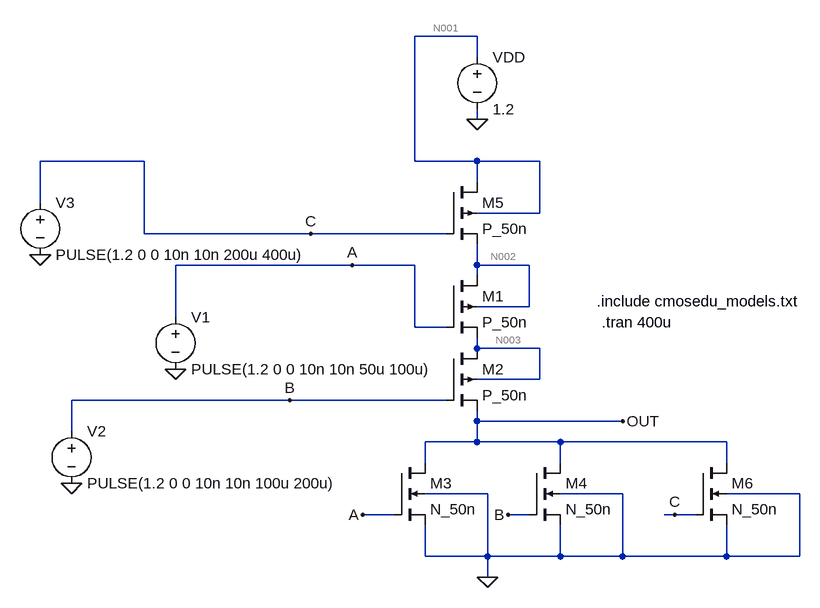
[diagram p0: schematic OR 2 entradas.asc]
OR 2 entradas.asc, the LTspice schematic file:
Version 4
SHEET 1 880 680
WIRE 208 -320 112 -320
WIRE 208 -288 208 -320
WIRE 208 -192 208 -208
WIRE -304 -128 -464 -128
WIRE 112 -128 112 -320
WIRE 208 -128 112 -128
WIRE 304 -128 208 -128
WIRE 208 -96 208 -128
WIRE -464 -64 -464 -128
WIRE 304 -48 304 -128
WIRE 304 -48 208 -48
WIRE -304 -16 -304 -128
WIRE -48 -16 -304 -16
WIRE 160 -16 -48 -16
WIRE 16 32 -256 32
WIRE 112 32 16 32
WIRE 208 32 208 0
WIRE 288 32 208 32
WIRE 208 48 208 32
WIRE 288 96 288 32
WIRE 288 96 208 96
WIRE -256 112 -256 32
WIRE 112 128 112 32
WIRE 160 128 112 128
WIRE 208 160 208 144
WIRE 304 160 208 160
WIRE 304 208 304 160
WIRE 304 208 208 208
WIRE -80 240 -416 240
WIRE 160 240 -80 240
WIRE 208 272 208 256
WIRE 432 272 208 272
WIRE -416 288 -416 240
WIRE 208 304 208 272
WIRE 208 304 128 304
WIRE 336 304 208 304
WIRE 592 304 336 304
WIRE 128 336 128 304
WIRE 336 336 336 304
WIRE 592 336 592 304
WIRE 224 384 128 384
WIRE 432 384 336 384
WIRE 704 384 592 384
WIRE 80 416 32 416
WIRE 288 416 256 416
WIRE 512 416 496 416
WIRE 544 416 512 416
WIRE 128 480 128 432
WIRE 224 480 224 384
WIRE 224 480 128 480
WIRE 336 480 336 432
WIRE 336 480 224 480
WIRE 432 480 432 384
WIRE 432 480 336 480
WIRE 592 480 592 432
WIRE 592 480 432 480
WIRE 704 480 704 384
WIRE 704 480 592 480
WIRE 224 512 224 480
FLAG 208 -192 0
FLAG 256 416 B
FLAG 32 416 A
FLAG 224 512 0
FLAG -256 192 0
FLAG -416 368 0
FLAG 432 272 OUT
FLAG -80 240 B
FLAG -464 16 0
FLAG -48 -16 C
FLAG 16 32 A
FLAG 512 416 C
SYMBOL pmos4 160 48 R0
SYMATTR InstName M1
SYMATTR Value P_50n
SYMATTR Value2 l=50n w=1.12u
SYMBOL pmos4 160 160 R0
SYMATTR InstName M2
SYMATTR Value P_50n
SYMATTR Value2 l=50n w=1.12u
SYMBOL nmos4 80 336 R0
SYMATTR InstName M3
SYMATTR Value N_50n
SYMATTR Value2 l=50n w=0.5u
SYMBOL nmos4 288 336 R0
SYMATTR InstName M4
SYMATTR Value N_50n
SYMATTR Value2 l=50n w=0.5u
SYMBOL voltage 208 -304 R0
WINDOW 123 0 0 Left 2
WINDOW 39 0 0 Left 2
SYMATTR InstName VDD
SYMATTR Value 1.2
SYMBOL voltage -256 96 R0
WINDOW 123 0 0 Left 2
WINDOW 39 0 0 Left 2
SYMATTR InstName V1
SYMATTR Value PULSE(1.2 0 0 10n 10n 50u 100u)
SYMBOL voltage -416 272 R0
WINDOW 123 0 0 Left 2
WINDOW 39 0 0 Left 2
SYMATTR InstName V2
SYMATTR Value PULSE(1.2 0 0 10n 10n 100u 200u)
SYMBOL pmos4 160 -96 R0
SYMATTR InstName M5
SYMATTR Value P_50n
SYMATTR Value2 l=50n w=1.12u
SYMBOL voltage -464 -80 R0
SYMATTR InstName V3
SYMATTR Value PULSE(1.2 0 0 10n 10n 200u 400u)
SYMBOL nmos4 544 336 R0
SYMATTR InstName M6
SYMATTR Value N_50n
SYMATTR Value2 l=50n w=0.5u
TEXT 392 88 Left 2 !.include cmosedu_models.txt
TEXT 400 120 Left 2 !.tran 400u

The netlist it stands for:
* OR 2 entradas.asc
M1 N002 A N003 N002 P_50n l=50n w=1.12u
M2 N003 B OUT N003 P_50n l=50n w=1.12u
M3 OUT A 0 0 N_50n l=50n w=0.5u
M4 OUT B 0 0 N_50n l=50n w=0.5u
VDD N001 0 1.2
V1 A 0 PULSE(1.2 0 0 10n 10n 50u 100u)
V2 B 0 PULSE(1.2 0 0 10n 10n 100u 200u)
M5 N001 C N002 N001 P_50n l=50n w=1.12u
V3 C 0 PULSE(1.2 0 0 10n 10n 200u 400u)
M6 OUT C 0 0 N_50n l=50n w=0.5u
.model NMOS NMOS
.model PMOS PMOS
.lib standard.mos
.include cmosedu_models.txt
.tran 400u
.backanno
.end

* Results of the author's LTspice run, read from the files saved beside the schematic
* Operating Point, zero values left out:
*   V(n002) = 1.178 V
*   V(a) = 1.2 V
*   V(n003) = 1.111 V
*   V(b) = 1.2 V
*   V(out) = 11.43 µV
*   V(n001) = 1.2 V
*   V(c) = 1.2 V
*   Id(M6) = 9.081 nA
*   Ig(M6) = 5.149 nA
*   Ib(M6) = -714.3 pA
*   Is(M6) = -13.52 nA
*   Id(M4) = 9.081 nA
*   Ig(M4) = 5.149 nA
*   Ib(M4) = -714.3 pA
*   Is(M4) = -13.52 nA
*   Id(M3) = 9.081 nA
*   Ig(M3) = 5.149 nA
*   Ib(M3) = -714.3 pA
*   Is(M3) = -13.52 nA
*   Id(M5) = 792.5 pA
*   Ig(M5) = 2.489 pA
*   Is(M5) = -795 pA
*   Id(M2) = 814.2 pA
*   Ig(M2) = 26.42 nA
*   Ib(M2) = 6.769 pA
*   Is(M2) = -27.24 nA
*   Id(M1) = 794.9 pA
*   Ig(M1) = 26.03 pA
*   Is(M1) = -821 pA
*   I(V3) = -5.152 nA
*   I(V2) = -31.57 nA
*   I(V1) = -5.175 nA
*   I(Vdd) = -792.5 pA
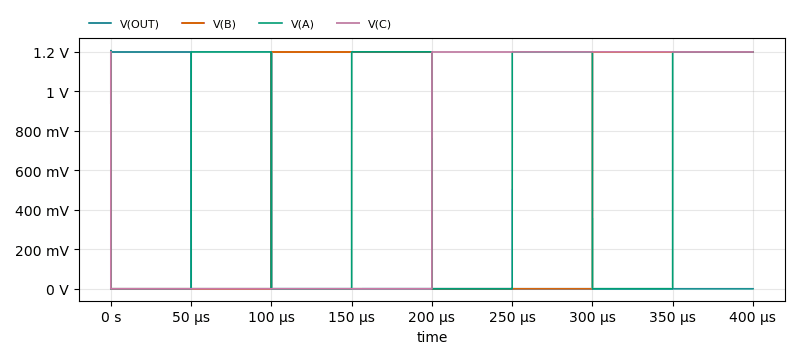
[diagram p1: Transient Analysis of OR 2 entradas.asc, plotted from the saved traces]
* Transient Analysis, 1 run:
*   V(OUT): min -145.4 µV, max 1.208 V, average 150.1 mV, rms 424.3 mV, last 11.24 µV
*   V(B): min 0 V, max 1.2 V, average 599.9 mV, rms 848.5 mV, last 1.2 V
*   V(A): min 0 V, max 1.2 V, average 599.9 mV, rms 848.4 mV, last 1.2 V
*   V(C): min 0 V, max 1.2 V, average 600 mV, rms 848.5 mV, last 1.2 V